# Altium schematic sheet lmr33620.schdoc
size 370 x 132 mm; SheetNumber: 1; SheetTotal: 1
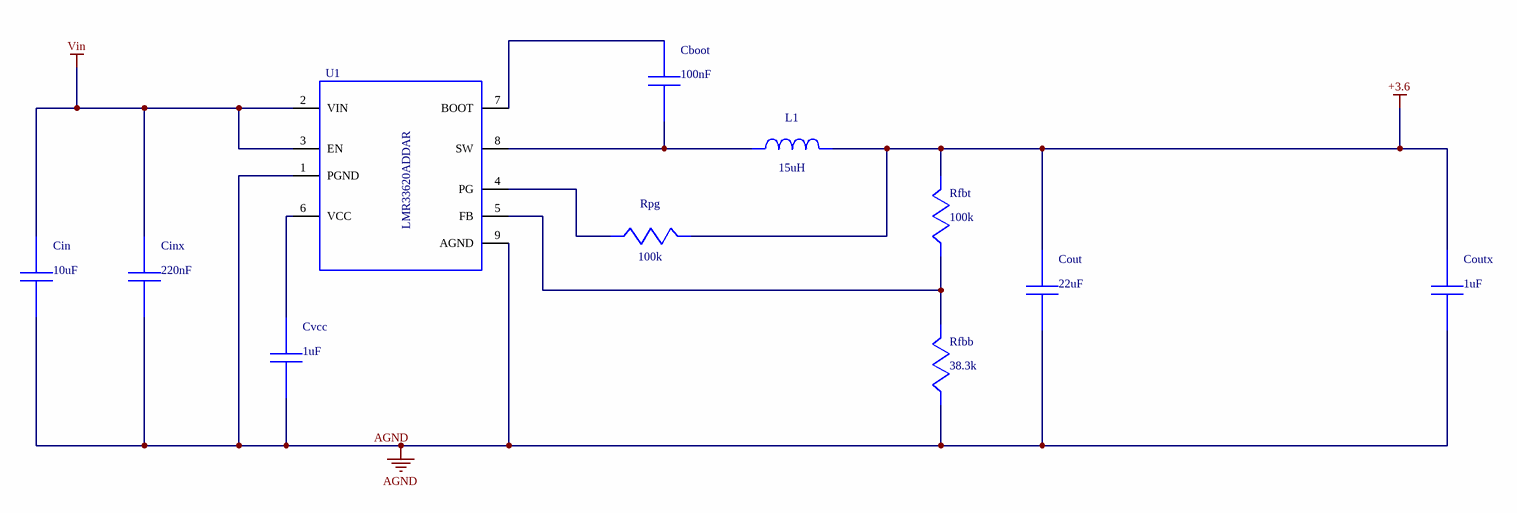
[diagram p0: lmr33620.schdoc]

## Parts
Cboot  value 100nF  [0805_C]  (hidden comment: HMK212B7104KG-T)
Cin  value 10uF  [1206_C]  (hidden comment: C3216X5R1H106K160AB)
Cinx  value 220nF  [1206_C]  (hidden comment: C3216X7R2A224K115AA)
Cout  value 22uF  [0603_C]  (hidden comment: GRM188R60J226MEA0D)
Coutx  value 1uF  [0805_C]  (hidden comment: GRM21BR71A105KA01L)
Cvcc  value 1uF  [0603_C]  (hidden comment: EMK107B7105KA-T)
L1  value 15uH  [CDRH127]  (hidden comment: CDRH127/LDNP-150MC)
Rfbb  value 38.3k  [0603_R]  (hidden comment: CRCW060338K3FKEA)
Rfbt  value 100k  [0805_R]  (hidden comment: ERJ-6ENF1003V)
Rpg  value 100k  [0603_R]  (hidden comment: CRCW0603100KFKEA)
U1  LMR33620ADDAR  [DDA0008J]

## Nets
+3.6: Cout.1 Coutx.1 L1.2 Rfbt.1 Rpg.1
AGND: Cin.2 Cinx.2 Cout.2 Coutx.2 Cvcc.2 Rfbb.2 U1.1(PGND) U1.9(AGND)
Vin: Cin.1 Cinx.1 U1.2(VIN) U1.3(EN)
NetCboot_1: Cboot.1 U1.7(BOOT)
NetCboot_2: Cboot.2 L1.1 U1.8(SW)
NetCvcc_1: Cvcc.1 U1.6(VCC)
NetRfbb_1: Rfbb.1 Rfbt.2 U1.5(FB)
NetRpg_2: Rpg.2 U1.4(PG)

## Library data of the parts
Cboot = HMK212B7104KG-T: BOM_Manufacturer: Taiyo Yuden; BOM_Manufacturer Part: HMK212B7104KG-T
Cin = C3216X5R1H106K160AB: C3216X5R1H106K16; BOM_Manufacturer: TDK; BOM_Manufacturer Part: C3216X5R1H106K160AB
Cinx = C3216X7R2A224K115AA: C3216X7R2A224K11; BOM_Manufacturer: TDK; BOM_Manufacturer Part: C3216X7R2A224K115AA
Cout = GRM188R60J226MEA0D: GRM188R60J226MEA; BOM_Manufacturer: MuRata; BOM_Manufacturer Part: GRM188R60J226MEA0D
Coutx = GRM21BR71A105KA01L: GRM21BR71A105KA0; BOM_Manufacturer: MuRata; BOM_Manufacturer Part: GRM21BR71A105KA01L
Cvcc = EMK107B7105KA-T: BOM_Manufacturer: Taiyo Yuden; BOM_Manufacturer Part: EMK107B7105KA-T
L1 = CDRH127/LDNP-150MC: CDRH127/LDNP-150; BOM_Manufacturer: Sumida; BOM_Manufacturer Part: CDRH127/LDNP-150MC
Rfbb = CRCW060338K3FKEA: BOM_Manufacturer: Vishay-Dale; BOM_Manufacturer Part: CRCW060338K3FKEA
Rfbt = ERJ-6ENF1003V: BOM_Manufacturer: Panasonic; BOM_Manufacturer Part: ERJ-6ENF1003V
Rpg = CRCW0603100KFKEA: BOM_Manufacturer: Vishay-Dale; BOM_Manufacturer Part: CRCW0603100KFKEA
U1 = LMR33620ADDAR: BOM_Manufacturer: Texas Instruments; BOM_Manufacturer Part: LMR33620ADDAR